# EAGLE design pico2_video (EAGLE 4.16)
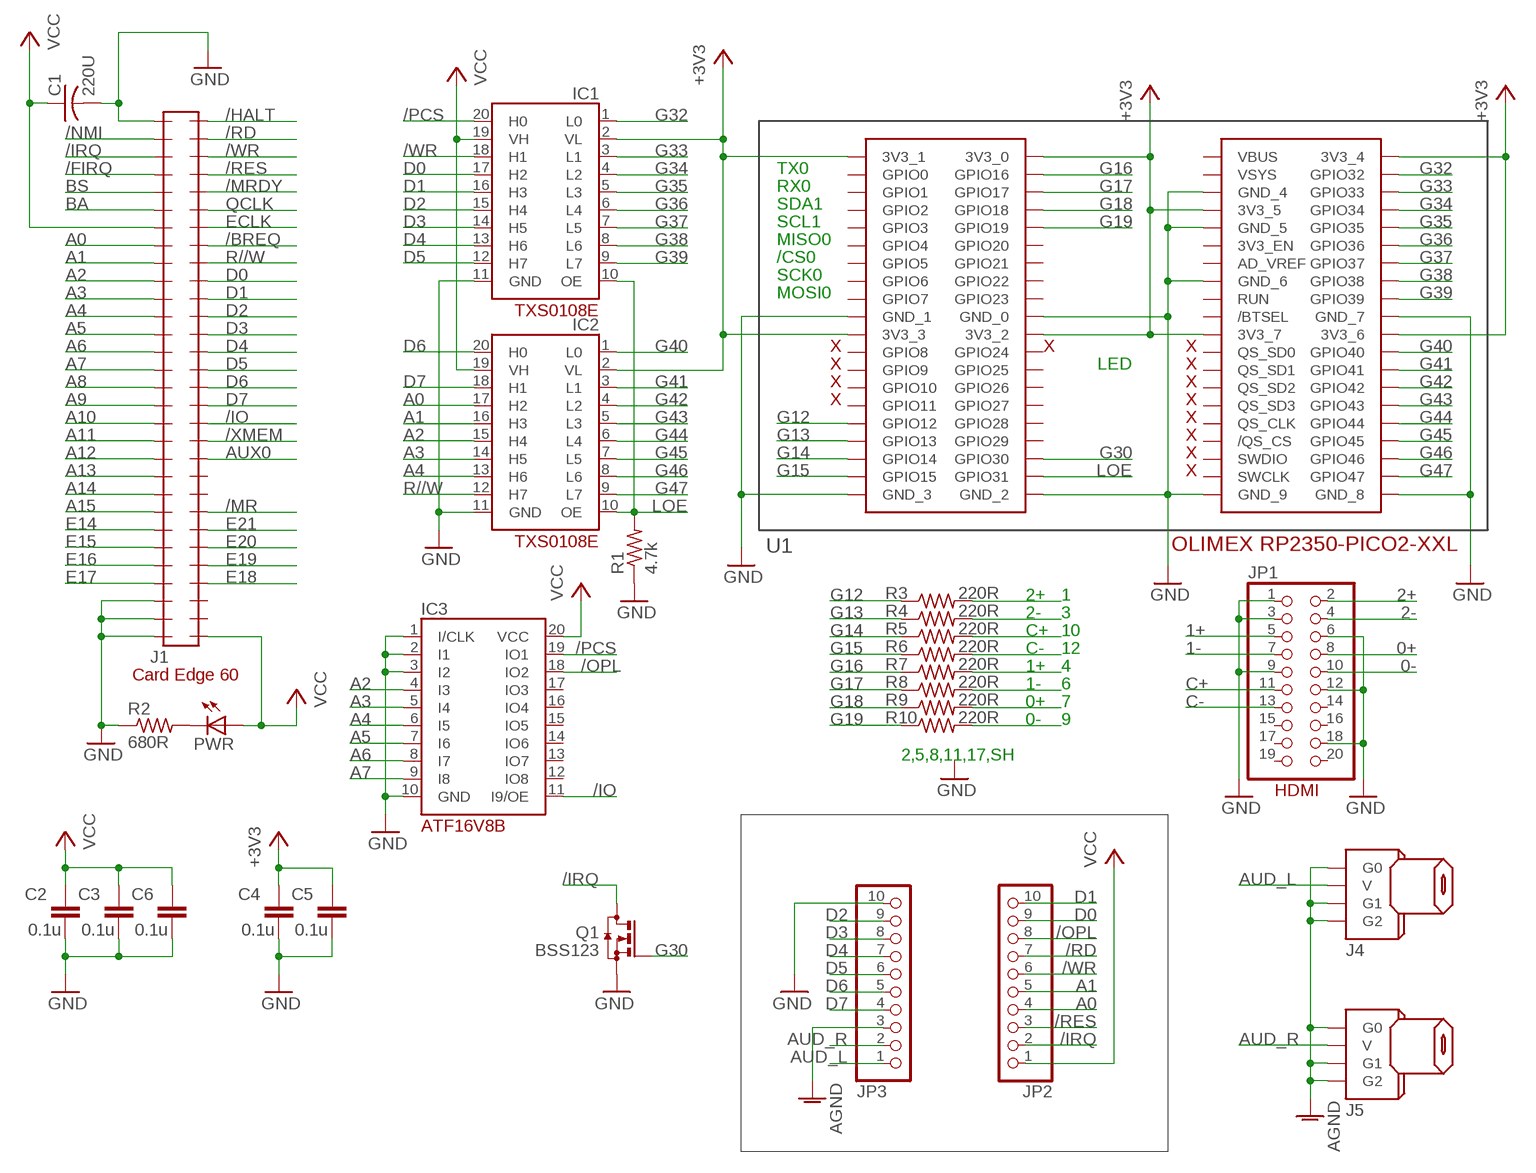
[diagram p0: schematic, sheet 1]

## Parts
C1  220U  C-US025-050X050  [C025-050X050]
C2  0.1u  C-EUC0603  [C0603]
C3  0.1u  C-EUC0603  [C0603]
C4  0.1u  C-EUC0603  [C0603]
C5  0.1u  C-EUC0603  [C0603]
C6  0.1u  C-EUC0603  [C0603]
IC1  TXS0108E  [TSSOP20]
IC2  TXS0108E  [TSSOP20]
IC3  PLD_ATF16V8B  [DIL20]
J1  CARDEDGE_2.54_60POS  CARDEDGE_2.54_60POSEDGE  [CARDEDGE_2.54_60POS]
J4  RCA_CONN_CUI_RCJ-014_CP-1403-ND  [RCA_JACK_CUI_RCJ-014_CP-1403-ND]
J5  RCA_CONN_CUI_RCJ-014_CP-1403-ND  [RCA_JACK_CUI_RCJ-014_CP-1403-ND]
JP1  PINHD-2X10  [2X10]
JP2  PINHD-1X10  [1X10]
JP3  PINHD-1X10  [1X10]
PWR  LED3MM  [LED3MM]
Q1  BSS123  [SOT23]
R1  4.7k  R-US_R0603  [R0603]
R2  680R  R-US_R0603  [R0603]
R3  220R  R-US_R0603  [R0603]
R4  220R  R-US_R0603  [R0603]
R5  220R  R-US_R0603  [R0603]
R6  220R  R-US_R0603  [R0603]
R7  220R  R-US_R0603  [R0603]
R8  220R  R-US_R0603  [R0603]
R9  220R  R-US_R0603  [R0603]
R10  220R  R-US_R0603  [R0603]
U1  OLIMEX_RP2350-PICO2-XXL  [OLIMEX_RP2350-PICO2-XXL]

## Nets
0+: JP1.8 R9.2
0-: JP1.10 R10.2
1+: JP1.5 R7.2
1-: JP1.7 R8.2
2+: JP1.2 R3.2
2-: JP1.4 R4.2
+3V3: C4.1 C5.1 IC1.2(VL) IC2.2(VL) U1.1.1(3V3_0) U1.1.2(3V3_1) U1.1.21(3V3_2) U1.1.22(3V3_3) U1.2.1(3V3_4) U1.2.8(3V3_5) U1.2.21(3V3_6) U1.2.22(3V3_7)
/BREQ: J1.53
/FIRQ: J1.4
/HALT: J1.60
/IO: IC3.11(I9/OE) J1.43
/IRQ: J1.3 JP2.2 Q1.3(D)
/MR: J1.38
/MRDY: J1.56
/NMI: J1.2
/OPL: IC3.18(IO2) JP2.8
/PCS: IC1.20(H0) IC3.19(IO1)
/RD: J1.59 JP2.7
/RES: J1.57 JP2.3
/WR: IC1.18(H1) J1.58 JP2.6
/XMEM: J1.42
A0: IC2.17(H2) J1.8 JP2.4
A1: IC2.16(H3) J1.9 JP2.5
A2: IC2.15(H4) IC3.4(I3) J1.10
A3: IC2.14(H5) IC3.5(I4) J1.11
A4: IC2.13(H6) IC3.6(I5) J1.12
A5: IC3.7(I6) J1.13
A6: IC3.8(I7) J1.14
A7: IC3.9(I8) J1.15
A8: J1.16
A9: J1.17
A10: J1.18
A11: J1.19
A12: J1.20
A13: J1.21
A14: J1.22
A15: J1.23
AGND [agnd]: J4.G0 J4.G1 J4.G2 J5.G0 J5.G1 J5.G2 JP3.3
AUD_L: J4.V JP3.1
AUD_R: J5.V JP3.2
AUX0: J1.41
BA: J1.6
BS: J1.5
C+: JP1.11 R5.2
C-: JP1.13 R6.2
D0: IC1.17(H2) J1.51 JP2.9
D1: IC1.16(H3) J1.50 JP2.10
D2: IC1.15(H4) J1.49 JP3.9
D3: IC1.14(H5) J1.48 JP3.8
D4: IC1.13(H6) J1.47 JP3.7
D5: IC1.12(H7) J1.46 JP3.6
D6: IC2.20(H0) J1.45 JP3.5
D7: IC2.18(H1) J1.44 JP3.4
E14: J1.24
E15: J1.25
E16: J1.26
E17: J1.27
E18: J1.34
E19: J1.35
E20: J1.36
E21: J1.37
ECLK: J1.54
G12: R3.1 U1.1.32(GPIO12)
G13: R4.1 U1.1.34(GPIO13)
G14: R5.1 U1.1.36(GPIO14)
G15: R6.1 U1.1.38(GPIO15)
G16: R7.1 U1.1.3(GPIO16)
G17: R8.1 U1.1.5(GPIO17)
G18: R9.1 U1.1.7(GPIO18)
G19: R10.1 U1.1.9(GPIO19)
G30: Q1.1(G) U1.1.35(GPIO30)
G32: IC1.1(L0) U1.2.3(GPIO32)
G33: IC1.3(L1) U1.2.5(GPIO33)
G34: IC1.4(L2) U1.2.7(GPIO34)
G35: IC1.5(L3) U1.2.9(GPIO35)
G36: IC1.6(L4) U1.2.11(GPIO36)
G37: IC1.7(L5) U1.2.13(GPIO37)
G38: IC1.8(L6) U1.2.15(GPIO38)
G39: IC1.9(L7) U1.2.17(GPIO39)
G40: IC2.1(L0) U1.2.23(GPIO40)
G41: IC2.3(L1) U1.2.25(GPIO41)
G42: IC2.4(L2) U1.2.27(GPIO42)
G43: IC2.5(L3) U1.2.29(GPIO43)
G44: IC2.6(L4) U1.2.31(GPIO44)
G45: IC2.7(L5) U1.2.33(GPIO45)
G46: IC2.8(L6) U1.2.35(GPIO46)
G47: IC2.9(L7) U1.2.37(GPIO47)
GND: C1.2 C2.2 C3.2 C4.2 C5.2 C6.2 IC1.11(GND) IC2.11(GND) IC3.1(I/CLK) IC3.2(I1) IC3.3(I2) IC3.10(GND) J1.1 J1.28 J1.29 J1.30 JP1.1 JP1.3 JP1.6 JP1.9 JP1.12 JP1.18 JP3.10 Q1.2(S) R1.1 R2.1 U1.1.19(GND_0) U1.1.20(GND_1) U1.1.39(GND_2) U1.1.40(GND_3) U1.2.6(GND_4) U1.2.10(GND_5) U1.2.16(GND_6) U1.2.19(GND_7) U1.2.39(GND_8) U1.2.40(GND_9)
LOE: IC1.10(OE) IC2.10(OE) R1.2 U1.1.37(GPIO31)
N$2: PWR.K(C) R2.2
QCLK: J1.55
R//W: IC2.12(H7) J1.52
VCC [supply]: C1.1 C2.1 C3.1 C6.1 IC1.19(VH) IC2.19(VH) IC3.20(VCC) J1.7 J1.31 JP2.1 PWR.A
Unconnected: IC3.12(IO8) IC3.13(IO7) IC3.14(IO6) IC3.15(IO5) IC3.16(IO4) IC3.17(IO3) J1.32 J1.33 J1.39 J1.40 JP1.14 JP1.15 JP1.16 JP1.17 JP1.19 JP1.20 U1.1.4(GPIO0) U1.1.6(GPIO1) U1.1.8(GPIO2) U1.1.10(GPIO3) U1.1.11(GPIO20) U1.1.12(GPIO4) U1.1.13(GPIO21) U1.1.14(GPIO5) U1.1.15(GPIO22) U1.1.16(GPIO6) U1.1.17(GPIO23) U1.1.18(GPIO7) U1.1.23(GPIO24) U1.1.24(GPIO8) U1.1.25(GPIO25) U1.1.26(GPIO9) U1.1.27(GPIO26) U1.1.28(GPIO10) U1.1.29(GPIO27) U1.1.30(GPIO11) U1.1.31(GPIO28) U1.1.33(GPIO29) U1.2.2(VBUS) U1.2.4(VSYS) U1.2.12(3V3_EN) U1.2.14(AD_VREF) U1.2.18(RUN) U1.2.20(/BTSEL) U1.2.24(QS_SD0) U1.2.26(QS_SD1) U1.2.28(QS_SD2) U1.2.30(QS_SD3) U1.2.32(QS_CLK) U1.2.34(/QS_CS) U1.2.36(SWDIO) U1.2.38(SWCLK)

## Notes on the sheet
- TX0
- RX0
- SDA1
- SCL1
- MISO0
- /CS0
- SCK0
- MOSI0
- X | X | X
- X | LED | X
- X | X
- X | X
- X
- X
- X
- X
- 2+ | 1
- 2- | 3
- C+ | 10
- C- | 12
- 1+ | 4
- 1- | 6
- 0+ | 7
- 0- | 9
- 2,5,8,11,17,SH
- HDMI

## Library data of the parts
C1 = rcl:C-US: CAPACITOR, American symbol
C2-C6 = rcl:C-EU: CAPACITOR, European symbol
IC1 IC2 = 07-Retrocomputing:TXS0108E
IC3 = 07-Retrocomputing:PLD_ATF16V8B
J1 = 07-Retrocomputing:CARDEDGE_2.54_60POS
J4 J5 = 07-Retrocomputing:RCA_CONN_CUI_RCJ-014_CP-1403-ND
JP1 = pinhead:PINHD-2X10: PIN HEADER
JP2 JP3 = pinhead:PINHD-1X10: PIN HEADER
PWR = led:LED: LED OSRAM: - CHIPLED LG R971, LG N971, LY N971, LG Q971, LY Q971, LO R971, LY R971 LH N974, LH R974 LS Q976, LO Q976, LY Q976 LO Q996 - Hyper CHIPLED LW Q18S LB Q993, LB Q99A, LB R99A - SideLED LS A670, LO A670, LY A670, LG A670, LP A670 LB A673, LV A673, LT A673, LW A673 LH A674 LY A675 LS A676, LA A676, LO A676, LY A676, LW A676 LS A679, LY A679, LG A679 - Hyper Micro SIDELED® LS Y876, LA Y876, LO Y876, LY Y876 LT Y87S - SmartLED LW L88C, LW L88S LB L89C, LB L89S, LG L890 LS L89K, LO L89K, LY L89K LS L896, LA L896, LO L896, LY L896 - TOPLED LS T670, LO T670, LY T670, LG T670, LP T670 LSG T670, LSP T670, LSY T670, LOP T670, LYG T670 LG T671, LOG T671, LSG T671 LB T673, LV T673, LT T673, LW T673 LH T674 LS T676, LA T676, LO T676, LY T676, LB T676, LH T676, LSB T676, LW T676 LB T67C, LV T67C, LT T67C, LS T67K, LO T67K, LY T67K, LW E67C LS E67B, LA E67B, LO E67B, LY E67B, LB E67C, LV E67C, LT E67C LW T67C LS T679, LY T679, LG T679 LS T770, LO T770, LY T770, LG T770, LP T770 LB T773, LV T773, LT T773, LW T773 LH T774 LS E675, LA E675, LY E675, LS T675 LS T776, LA T776, LO T776, LY T776, LB T776 LHGB T686 LT T68C, LB T68C - Hyper Mini TOPLED® LB M676 - Mini TOPLED Santana® LG M470 LS M47K, LO M47K, LY M47K Source: http://www.osram.convergy.de - LUMILED® LXK2-PW12-R00, LXK2-PW12-S00, LXK2-PW14-U00, LXK2-PW14-V00 LXK2-PM12-R00, LXK2-PM12-S00, LXK2-PM14-U00 LXK2-PE12-Q00, LXK2-PE12-R00, LXK2-PE12-S00, LXK2-PE14-T00, LXK2-PE14-U00 LXK2-PB12-K00, LXK2-PB12-L00, LXK2-PB12-M00, LXK2-PB14-N00, LXK2-PB14-P00, LXK2-PB14-Q00 LXK2-PR12-L00, LXK2-PR12-M00, LXK2-PR14-Q00, LXK2-PR14-R00 LXK2-PD12-Q00, LXK2-PD12-R00, LXK2-PD12-S00 LXK2-PH12-R00, LXK2-PH12-S00 LXK2-PL12-P00, LXK2-PL12-Q00, LXK2-PL12-R00 Source: www.luxeon.com
Q1 = transistor-small-signal:BSS123: N-CHANNEL MOS FET
R1-R10 = rcl:R-US_: RESISTOR, American symbol
U1 = 07-Retrocomputing:OLIMEX_RP2350-PICO2-XXL

## Net classes
0 default: width 0.203 mm, drill 0.203 mm, clearance 0.254 mm
1 supply: width 0.305 mm, drill 0.203 mm, clearance 0.254 mm
2 agnd: width 0.305 mm, drill 0.203 mm, clearance 0.254 mm

## Board
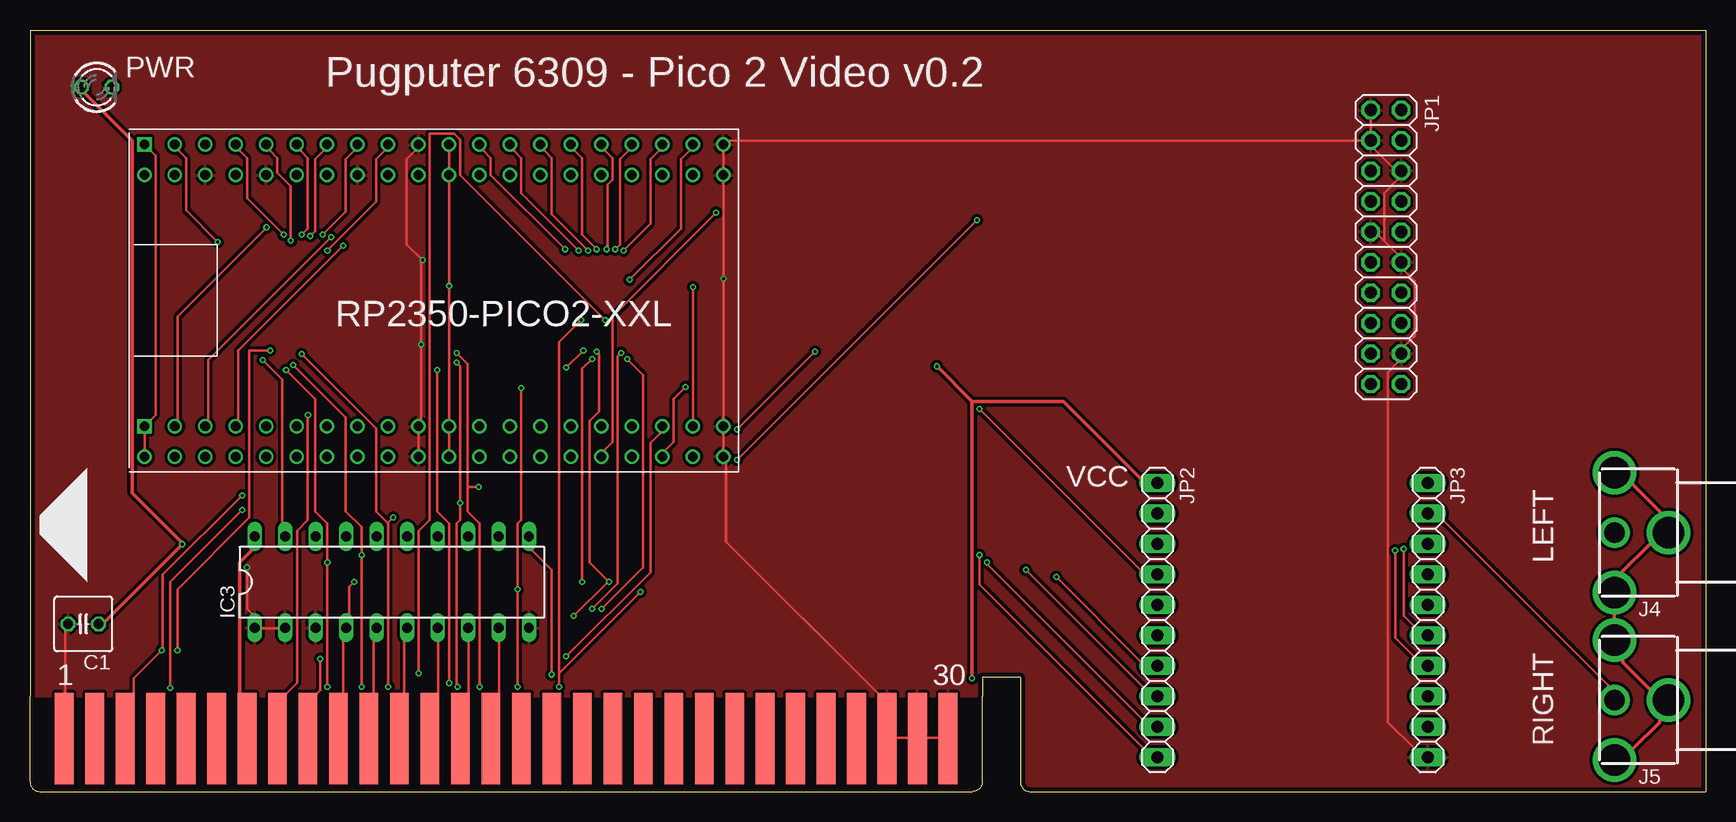
[diagram p1: board, top side]
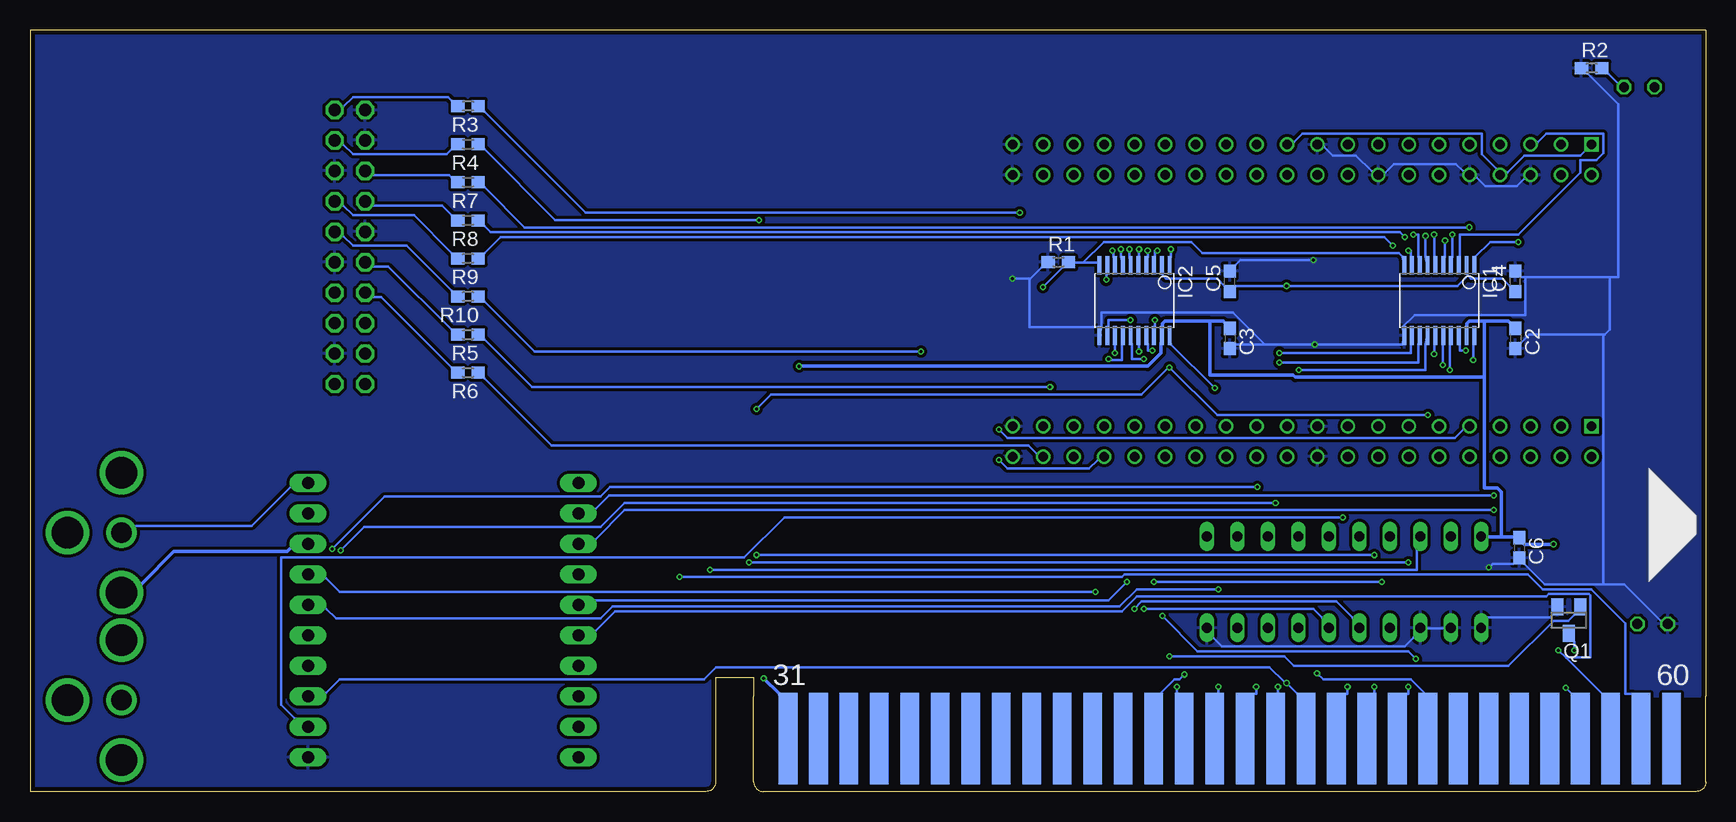
[diagram p2: board, bottom side, seen from below]

Size 139.7 x 63.5 mm. Coordinates in mm from the lower left corner, seen from the top.
Outline: 0,7.94 0,63.5 139.7,63.5 139.7,0 83.34,0 arc-90 82.55,0.79 82.55,9.53 79.38,9.53 79.38,7.94
Copper layers (1*16): Top 0.0356mm / dielectric 1.6mm / Bottom 0.0356mm
Design rules "oshpark-2layer": minimum track width 6mil, minimum drill 10mil, track to track 6mil, track to pad 6mil, pad to pad 6mil, via to via 6mil, smd to smd 6mil, copper to edge 15mil, drill to drill 6mil, minimum pad ring 5mil, minimum via ring 5mil, stop-mask expansion 2.5mil, vias tented up to drill 0mil, thermal gap 10mil

### Footprints (pad centres in the part's own frame; a part is rotated, then mirrored left to right if it is on the bottom)
C025-050X050 = drill 0.813 octagon: 1 -1.27,0; 2 1.27,0
C0603 = smd 1.1 x 1: 1 -0.85,0; 2 0.85,0
TSSOP20 = smd 1.5 x 0.35: 1 -2.925,2.925; 2 -2.925,2.275; 3 -2.925,1.625; 4 -2.925,0.975; 5 -2.925,0.325; 6 -2.925,-0.325; 7 -2.925,-0.975; 8 -2.925,-1.625; 9 -2.925,-2.275; 10 -2.925,-2.925; 11 2.925,-2.925; 12 2.925,-2.275; 13 2.925,-1.625; 14 2.925,-0.975; 15 2.925,-0.325; 16 2.925,0.325; 17 2.925,0.975; 18 2.925,1.625; 19 2.925,2.275; 20 2.925,2.925
DIL20 = drill 0.813 long: 1 -11.43,-3.81; 2 -8.89,-3.81; 3 -6.35,-3.81; 4 -3.81,-3.81; 5 -1.27,-3.81; 6 1.27,-3.81; 7 3.81,-3.81; 8 6.35,-3.81; 9 8.89,-3.81; 10 11.43,-3.81; 11 11.43,3.81; 12 8.89,3.81; 13 6.35,3.81; 14 3.81,3.81; 15 1.27,3.81; 16 -1.27,3.81; 17 -3.81,3.81; 18 -6.35,3.81; 19 -8.89,3.81; 20 -11.43,3.81
CARDEDGE_2.54_60POS = smd 1.556 x 7.62: 1 -36.83,4.41; 2 -34.29,4.41; 3 -31.75,4.41; 4 -29.21,4.41; 5 -26.67,4.41; 6 -24.13,4.41; 7 -21.59,4.41; 8 -19.05,4.41; 9 -16.51,4.41; 10 -13.97,4.41; 11 -11.43,4.41; 12 -8.89,4.41; 13 -6.35,4.41; 14 -3.81,4.41; 15 -1.27,4.41; 16 1.27,4.41; 17 3.81,4.41; 18 6.35,4.41; 19 8.89,4.41; 20 11.43,4.41; 21 13.97,4.41; 22 16.51,4.41; 23 19.05,4.41; 24 21.59,4.41; 25 24.13,4.41; 26 26.67,4.41; 27 29.21,4.41; 28 31.75,4.41; 29 34.29,4.41; 30 36.83,4.41 | smd 1.556 x 7.62 bottom: 31 36.83,4.41; 32 34.29,4.41; 33 31.75,4.41; 34 29.21,4.41; 35 26.67,4.41; 36 24.13,4.41; 37 21.59,4.41; 38 19.05,4.41; 39 16.51,4.41; 40 13.97,4.41; 41 11.43,4.41; 42 8.89,4.41; 43 6.35,4.41; 44 3.81,4.41; 45 1.27,4.41; 46 -1.27,4.41; 47 -3.81,4.41; 48 -6.35,4.41; 49 -8.89,4.41; 50 -11.43,4.41; 51 -13.97,4.41; 52 -16.51,4.41; 53 -19.05,4.41; 54 -21.59,4.41; 55 -24.13,4.41; 56 -26.67,4.41; 57 -29.21,4.41; 58 -31.75,4.41; 59 -34.29,4.41; 60 -36.83,4.41
RCA_JACK_CUI_RCJ-014_CP-1403-ND = drill 2.6 round: G0 -5,0; G1 0,4.5; G2 5,0 | drill 1.7 round: V 0,0
2X10 = drill 1.016 octagon: 1 -11.43,-1.27; 2 -11.43,1.27; 3 -8.89,-1.27; 4 -8.89,1.27; 5 -6.35,-1.27; 6 -6.35,1.27; 7 -3.81,-1.27; 8 -3.81,1.27; 9 -1.27,-1.27; 10 -1.27,1.27; 11 1.27,-1.27; 12 1.27,1.27; 13 3.81,-1.27; 14 3.81,1.27; 15 6.35,-1.27; 16 6.35,1.27; 17 8.89,-1.27; 18 8.89,1.27; 19 11.43,-1.27; 20 11.43,1.27
1X10 = drill 1.016 long: 1 -11.43,0; 2 -8.89,0; 3 -6.35,0; 4 -3.81,0; 5 -1.27,0; 6 1.27,0; 7 3.81,0; 8 6.35,0; 9 8.89,0; 10 11.43,0
LED3MM = drill 0.813 octagon: A -1.27,0; K 1.27,0
SOT23 = smd 1 x 1.4: 1 -0.95,-1.1; 2 0.95,-1.1; 3 0,1.1
R0603 = smd 1.1 x 1: 1 -0.85,0; 2 0.85,0
OLIMEX_RP2350-PICO2-XXL = drill 0.8 square: 1.1 -10.5,0; 2.1 12.995,0 | drill 0.8 round: 1.2 -13.04,0; 1.3 -10.5,-2.54; 1.4 -13.04,-2.54; 1.5 -10.5,-5.08; 1.6 -13.04,-5.08; 1.7 -10.5,-7.62; 1.8 -13.04,-7.62; 1.9 -10.5,-10.16; 1.10 -13.04,-10.16; 1.11 -10.5,-12.7; 1.12 -13.04,-12.7; 1.13 -10.5,-15.24; 1.14 -13.04,-15.24; 1.15 -10.5,-17.78; 1.16 -13.04,-17.78; 1.17 -10.5,-20.32; 1.18 -13.04,-20.32; 1.19 -10.5,-22.86; 1.20 -13.04,-22.86; 1.21 -10.5,-25.4; 1.22 -13.04,-25.4; 1.23 -10.5,-27.94; 1.24 -13.04,-27.94; 1.25 -10.5,-30.48; 1.26 -13.04,-30.48; 1.27 -10.5,-33.02; 1.28 -13.04,-33.02; 1.29 -10.5,-35.56; 1.30 -13.04,-35.56; 1.31 -10.5,-38.1; 1.32 -13.04,-38.1; 1.33 -10.5,-40.64; 1.34 -13.04,-40.64; 1.35 -10.5,-43.18; 1.36 -13.04,-43.18; 1.37 -10.5,-45.72; 1.38 -13.04,-45.72; 1.39 -10.5,-48.26; 1.40 -13.04,-48.26; 2.2 10.455,0; 2.3 12.995,-2.54; 2.4 10.455,-2.54; 2.5 12.995,-5.08; 2.6 10.455,-5.08; 2.7 12.995,-7.62; 2.8 10.455,-7.62; 2.9 12.995,-10.16; 2.10 10.455,-10.16; 2.11 12.995,-12.7; 2.12 10.455,-12.7; 2.13 12.995,-15.24; 2.14 10.455,-15.24; 2.15 12.995,-17.78; 2.16 10.455,-17.78; 2.17 12.995,-20.32; 2.18 10.455,-20.32; 2.19 12.995,-22.86; 2.20 10.455,-22.86; 2.21 12.995,-25.4; 2.22 10.455,-25.4; 2.23 12.995,-27.94; 2.24 10.455,-27.94; 2.25 12.995,-30.48; 2.26 10.455,-30.48; 2.27 12.995,-33.02; 2.28 10.455,-33.02; 2.29 12.995,-35.56; 2.30 10.455,-35.56; 2.31 12.995,-38.1; 2.32 10.455,-38.1; 2.33 12.995,-40.64; 2.34 10.455,-40.64; 2.35 12.995,-43.18; 2.36 10.455,-43.18; 2.37 12.995,-45.72; 2.38 10.455,-45.72; 2.39 12.995,-48.26; 2.40 10.455,-48.26

### Placement (x,y rotation side)
C1  4.45,13.97 180 top
C2  15.88,37.78 270 bottom
C3  39.69,37.78 270 bottom
C4  15.88,42.55 90 bottom
C5  39.69,42.55 90 bottom
C6  15.56,20.32 270 bottom
IC1  22.23,40.96 270 bottom
IC2  47.62,40.96 270 bottom
IC3  30.16,17.46 0 top
J1  39.69,0 0 top
J4  132.08,21.59 270 top
J5  132.08,7.62 270 top
JP1  113.03,45.4 270 top
JP2  93.98,14.29 270 top
JP3  116.52,14.29 270 top
PWR  5.56,58.74 0 top
Q1  11.43,14.29 180 bottom
R1  53.98,44.13 0 bottom
R2  9.53,60.33 0 bottom
R3  103.19,57.15 180 bottom
R4  103.19,53.98 180 bottom
R5  103.19,38.1 180 bottom
R6  103.19,34.92 180 bottom
R7  103.19,50.8 180 bottom
R8  103.19,47.62 180 bottom
R9  103.19,44.45 180 bottom
R10  103.19,41.27 180 bottom
U1  9.53,40.96 90 top

### Tracks (layer width: path | path; a pad name or v marks a point on that pad's centre or on a via)
0+
  Bottom 0.203: R9.2 104.55,44.91 107.7,48.06 112.78,48.06 113.59,48.87 JP1.8
0-
  Bottom 0.203: R10.2 104.55,41.76 108.31,45.52 112.78,45.52 113.59,46.33 JP1.10
1+
  Bottom 0.203: R7.2 104.55,51.21 104.75,51.41 111.05,51.41 JP1.5
1-
  Bottom 0.203: R8.2 104.55,48.06 105.36,48.87 111.05,48.87 JP1.7
2+
  Bottom 0.203: R3.2 104.55,57.61 104.85,57.91 112.78,57.91 113.59,57.1 JP1.2
2-
  Bottom 0.203: R4.2 104.55,53.54 104.95,53.14 112.78,53.14 113.59,53.95 JP1.4
+3V3  (via drill 0.25)
  Top 0.203: U1.1.2 9.55,28.45 9.55,29.87 U1.1.1 10.06,30.99 10.46,31.39 10.46,53.03 10.06,53.44 U1.2.1 | U1.1.22 34.95,28.45 34.95,29.87 U1.1.21 34.95,30.99 v34.95,42.16 34.95,50.9 U1.2.22 34.95,51.92 34.95,53.44 U1.2.21
  Bottom 0.203: U1.2.1 10.06,53.44 10.46,53.03 15.14,53.03 16.56,51.61 U1.2.8 17.48,51.92 18.69,53.14 18.69,54.86 33.63,54.86 34.34,54.15 U1.2.21 | 19.86,43.03 20.02,43.18 IC1.2 | 19.86,43.03 19.61,42.77 16.97,42.77 16.36,42.16 C4.1 | IC2.2 45.41,43.18 45.01,42.77 40.74,42.77 40.13,42.16 C5.1 39.22,42.16 v34.95,42.16 20.73,42.16 19.86,43.03
/IO  (via drill 0.25)
  Top 0.203: v43.48,9.75 43.48,18.49 41.86,20.12 IC3.11
  Bottom 0.203: v43.48,9.75 43.89,9.35 44.3,9.35 45.52,8.13 J1.43
/IRQ  (via drill 0.25)
  Top 0.203: J1.3 8.64,8.13 8.64,9.45 v10.97,11.79 11.07,11.99 11.07,18.09 v17.68,24.69
  Bottom 0.203: v10.97,11.79 10.97,12.5 Q1.3 | v17.68,24.69 91.44,24.69 92.56,23.57 JP2.2
/OPL  (via drill 0.25)
  Top 0.203: v83.01,18.49 92.86,8.64 JP2.8
  Bottom 0.203: v83.01,18.49 24.08,18.49 24.08,20.12 IC3.18
/PCS  (via drill 0.25)
  Top 0.203: v19.41,35.97 21.03,34.34 21.03,22.45 IC3.19
  Bottom 0.203: v19.41,35.97 19.41,37.29 IC1.20
/RD  (via drill 0.25)
  Top 0.203: v85.55,17.88 92.56,10.87 JP2.7
  Bottom 0.203: v85.55,17.88 48.67,17.88 48.46,18.09 14.83,18.09 13.61,16.87 9.55,16.87 6.71,14.02 6.71,8.13 6.1,8.13 J1.59
/RES  (via drill 0.25)
  Top 0.203: v17.68,23.47 11.68,17.48 v11.68,8.64
  Bottom 0.203: v17.68,23.47 90.12,23.47 92.56,21.03 JP2.3 | v11.68,8.64 11.18,8.13 J1.57
/WR  (via drill 0.25)
  Top 0.203: v20.02,36.78 18.29,36.78 18.29,22.86 12.29,16.87 v12.29,11.79
  Bottom 0.203: v20.02,36.78 20.52,36.78 20.52,37.29 IC1.18 | 11.63,11.12 8.64,8.13 J1.58 | 11.63,11.12 v12.29,11.79 | JP2.6 92.56,13.41 90.93,15.04 48.67,15.04 47.45,16.26 13.31,16.26 13.11,16.46 9.75,16.46 9.65,16.36 9.65,11.18 11.58,11.18 11.63,11.12
A0  (via drill 0.25)
  Top 0.203: v44.7,35.36 v46.13,36.78 | v23.16,31.39 23.16,22.66 22.25,21.74 22.25,9.04 21.34,8.13 J1.8 | v79.15,31.9 92.56,18.49 JP2.4
  Bottom 0.203: v46.13,36.78 46.53,36.78 46.53,37.29 IC2.17 | v23.16,31.39 40.74,31.39 v44.7,35.36 44.91,35.26 47.04,33.12 77.93,33.12 v79.15,31.9
A1  (via drill 0.25)
  Top 0.203: v47.24,36.68 47.45,36.47 47.45,31.7 46.63,30.89 46.63,19.1 v48.26,17.48 48.06,17.37 v45.31,14.63 | v24.18,11.07 24.18,8.43 23.88,8.13 J1.9
  Bottom 0.203: v47.24,36.68 47.24,37.29 IC2.16 | v48.26,17.48 49.78,15.95 92.56,15.95 JP2.5 | v24.18,11.07 24.79,11.68 42.37,11.68 v45.31,14.63
A2  (via drill 0.25)
  Top 0.203: v46.84,36.07 46.02,35.26 v46.02,17.48 | v27.03,17.48 26.62,17.07 26.62,14.83 IC3.4 26.11,12.5 26.11,8.13 J1.10
  Bottom 0.203: v46.84,36.07 47.85,36.07 47.85,37.29 IC2.15 | v27.03,17.48 v46.02,17.48
A3  (via drill 0.25)
  Top 0.203: v49.78,36.07 51.1,34.75 51.1,18.69 v47.65,15.24 | J1.11 28.65,8.13 28.65,12.5 IC3.5
  Bottom 0.203: v49.78,36.07 49.68,35.97 48.67,35.97 48.67,37.29 IC2.14 | v47.65,15.24 47.04,15.85 30.79,15.85 29.46,14.53 IC3.5
A4  (via drill 0.25)
  Top 0.203: v49.28,36.58 48.97,36.27 48.97,17.37 v46.84,15.24 | J1.12 31.19,8.13 31.19,12.5 IC3.6
  Bottom 0.203: v49.28,36.58 49.28,37.29 IC2.13 | v46.84,15.24 32.72,15.24 32,14.53 IC3.6
A5
  Top 0.203: IC3.7 34.04,12.5 34.04,8.13 J1.13
A6
  Top 0.203: IC3.8 36.58,12.5 36.58,8.13 J1.14
A7
  Top 0.203: IC3.9 39.12,12.5 39.12,8.13 J1.15
AGND
  Top 0.305: J4.G0 133.6,25.6 135.84,23.37 J4.G1 135.03,20.62 132.79,18.39 J4.G2 J5.G0 132.79,10.87 132.79,10.77 135.03,8.53 J5.G1 135.84,5.89 135.84,5.79 133.6,3.56 J5.G2
  Bottom 0.305: JP3.3 117.96,20.32 118.26,20.02 127.71,20.02 130.35,17.37 J4.G2
AUD_L
  Bottom 0.203: JP3.1 117.96,25.4 121.21,22.15 130.86,22.15 J4.V
AUD_R
  Top 0.203: JP3.2 117.75,22.66 131.57,8.84 J5.V
C+
  Bottom 0.203: R5.2 104.55,38.51 109.83,43.79 111.05,43.79 JP1.11
C-
  Bottom 0.203: R6.2 104.55,35.36 110.44,41.25 111.05,41.25 JP1.13
D0  (via drill 0.25)
  Top 0.203: v21.34,35.15 23.77,32.72 23.77,23.37 24.79,22.35 v24.79,19.1 v24.79,8.74 | v79.76,19.1 79.76,19 92.76,5.99 JP2.9
  Bottom 0.203: v21.34,35.15 21.34,37.29 IC1.17 | v24.79,8.74 24.79,8.13 24.99,8.13 J1.51 | v24.79,19.1 v79.76,19.1
D1  (via drill 0.25)
  Top 0.203: v21.95,35.56 26.31,31.19 26.31,23.37 27.64,22.05 v27.64,19.71 v27.64,8.74 | v79.15,19.71 79.15,17.27 92.86,3.56 JP2.10
  Bottom 0.203: v21.95,35.56 21.95,37.29 IC1.16 | v27.64,8.74 27.64,8.13 J1.50 | v27.64,19.71 v79.15,19.71
D2  (via drill 0.25)
  Top 0.203: v22.66,36.47 28.85,30.28 28.85,23.37 29.82,22.4 | 29.82,22.4 29.87,22.35 v29.87,8.74 | 29.82,22.4 v30.28,22.86
  Bottom 0.203: v22.66,36.47 22.66,37.29 IC1.15 | v29.87,8.74 29.87,8.13 30.07,8.13 J1.49 | v30.28,22.86 76.81,22.86 80.16,19.51 118.77,19.51 118.77,7.21 117.65,6.1 JP3.9
D3  (via drill 0.25)
  Top 0.203: v33.93,35.15 33.93,23.37 34.95,22.35 v34.95,9.04
  Bottom 0.203: v33.93,35.15 23.37,35.15 23.37,37.29 IC1.14 | J1.48 34.04,8.13 v34.95,9.04 35.15,9.14 36.37,10.36 82.5,10.36 83.52,9.35 113.89,9.35 115.01,8.23 JP3.8
D4  (via drill 0.25)
  Top 0.203: v35.56,35.76 35.87,35.46 v35.87,24.08 35.87,22.66 35.56,22.35 35.56,8.84 v35.66,8.74 | v113.79,20.12 113.79,12.8 115.42,11.18 JP3.7
  Bottom 0.203: v35.56,35.76 23.98,35.76 23.98,37.29 IC1.13 | v35.66,8.74 35.66,8.13 J1.47 | v113.79,20.12 111.86,22.05 92.15,22.05 90.12,24.08 v35.87,24.08
D5  (via drill 0.25)
  Top 0.203: v35.56,36.58 36.47,35.66 36.47,25.4 | 36.47,25.4 36.47,23.37 37.49,22.35 v37.49,8.74 | v114.5,20.22 114.5,14.63 115.42,13.72 JP3.6 | 36.47,25.4 v37.39,25.4
  Bottom 0.203: v35.56,36.58 24.59,36.58 24.59,37.29 IC1.12 | v37.49,8.74 37.49,8.13 37.69,8.13 J1.46 | v114.5,20.22 110.13,24.59 92.15,24.59 91.34,25.4 v37.39,25.4
D6  (via drill 0.25)
  Top 0.203: v40.95,33.63 40.95,22.66 40.64,22.35 v40.64,16.87 v40.64,8.74
  Bottom 0.203: v40.95,33.63 44.6,37.29 IC2.20 | v40.64,8.74 40.64,8.13 J1.45 | v40.64,16.87 47.45,16.87 48.87,15.44 91.14,15.44 92.15,14.43 114.2,14.43 115.01,15.24 JP3.5
D7  (via drill 0.25)
  Top 0.203: v45.92,39.32 44.09,37.49 44.09,9.86 | v44.09,8.74 44.09,9.86 | 44.09,9.86 v50.9,16.66
  Bottom 0.203: v45.92,39.32 45.92,38.71 IC2.18 | v44.09,8.74 44.09,8.13 J1.44 | v50.9,16.66 113.89,16.66 115.01,17.78 JP3.4
G12  (via drill 0.25)
  Top 0.203: v57.2,48.26 48.56,39.62 48.56,29.16 47.85,28.45 U1.1.32
  Bottom 0.203: v57.2,48.26 93.37,48.26 101.8,56.69 R3.1
G13  (via drill 0.25)
  Top 0.203: v58.93,27.64 v78.94,47.65
  Bottom 0.203: v78.94,47.65 95.91,47.65 101.8,53.54 R4.1 | v58.93,27.64 58.22,26.92 51.41,26.92 50.7,27.64 U1.1.34
G14  (via drill 0.25)
  Top 0.203: v54.66,33.73 53.65,32.72 53.65,29.16 52.93,28.45 U1.1.36
  Bottom 0.203: v54.66,33.73 97.84,33.73 101.8,37.69 R5.1
G15
  Bottom 0.203: R6.1 101.8,34.44 96.22,28.85 56.49,28.85 55.78,28.14 U1.1.38
G16  (via drill 0.25)
  Top 0.203: v19.71,47.04 12.29,39.62 12.29,30.99 U1.1.3
  Bottom 0.203: v19.71,47.04 98.45,47.04 101.8,50.39 R7.1
G17  (via drill 0.25)
  Top 0.203: v25.09,46.23 14.83,35.97 14.83,30.99 U1.1.5
  Bottom 0.203: v25.09,46.23 25.5,46.63 101.3,46.63 101.8,47.14 R8.1
G18  (via drill 0.25)
  Top 0.203: v26.11,45.52 17.37,36.78 17.37,30.99 U1.1.7
  Bottom 0.203: v26.11,45.52 26.82,46.23 100.48,46.23 101.8,44.91 R9.1
G19  (via drill 0.25)
  Top 0.203: v58.93,30.18 v65.43,36.68
  Bottom 0.203: v65.43,36.68 97.64,36.68 101.8,40.84 R10.1 | v58.93,30.18 58.22,29.46 20.93,29.46 20.22,30.18 U1.1.9
G30  (via drill 0.25)
  Top 0.203: v44.7,11.28 51.71,18.29 51.71,29.06 52.53,29.87 U1.1.35
  Bottom 0.203: v44.7,11.28 35.15,11.28 34.34,10.46 16.46,10.46 12.7,14.22 11.48,14.22 10.97,14.73 Q1.1
G32  (via drill 0.25)
  Top 0.203: v15.65,45.82 13.01,48.46 13.01,52.83 12.39,53.44 U1.2.3
  Bottom 0.203: v15.65,45.82 17.98,45.82 19.2,44.6 IC1.1
G33
  Bottom 0.203: IC1.3 20.52,44.6 20.52,46.43 15.65,46.43 10.46,51.61 10.46,52.63 9.14,52.63 8.53,53.24 8.53,54.86 13.31,54.86 14.02,54.15 U1.2.5
G34  (via drill 0.25)
  Top 0.203: v21.13,46.43 18.09,49.48 18.09,52.83 17.48,53.44 U1.2.7
  Bottom 0.203: v21.13,46.43 21.13,44.6 IC1.4
G35  (via drill 0.25)
  Top 0.203: v21.74,45.92 21.74,50.49 20.62,51.61 20.62,52.83 20.02,53.44 U1.2.9
  Bottom 0.203: v21.74,45.92 21.74,44.6 IC1.5
G36  (via drill 0.25)
  Top 0.203: v22.66,46.43 23.16,46.94 23.16,52.83 22.55,53.44 U1.2.11
  Bottom 0.203: v22.66,46.43 22.66,44.6 IC1.6
G37  (via drill 0.25)
  Top 0.203: v23.37,46.33 23.77,46.74 23.77,52.73 24.49,53.44 U1.2.13
  Bottom 0.203: v23.37,46.33 23.37,44.6 IC1.7
G38  (via drill 0.25)
  Top 0.203: v24.38,46.43 26.31,48.36 26.31,52.73 27.03,53.44 U1.2.15
  Bottom 0.203: v24.38,46.43 23.98,46.43 23.98,44.6 IC1.8
G39  (via drill 0.25)
  Top 0.203: v24.79,45.11 28.85,49.17 28.85,52.73 29.57,53.44 U1.2.17
  Bottom 0.203: v24.79,45.11 24.59,45.11 24.59,44.6 IC1.9
G40  (via drill 0.25)
  Top 0.203: v44.6,45.21 38.41,51.41 38.41,52.83 37.8,53.44 U1.2.23
  Bottom 0.203: v44.6,45.21 44.6,44.6 IC2.1
G41  (via drill 0.25)
  Top 0.203: v45.72,45.11 40.95,49.89 40.95,52.83 40.34,53.44 U1.2.25
  Bottom 0.203: v45.72,45.11 45.92,45.11 45.92,44.6 IC2.3
G42  (via drill 0.25)
  Top 0.203: v46.53,45.11 43.48,48.16 43.48,52.83 42.88,53.44 U1.2.27
  Bottom 0.203: v46.53,45.11 46.53,44.6 IC2.4
G43  (via drill 0.25)
  Top 0.203: v47.24,45.21 46.02,46.43 46.02,52.83 45.41,53.44 U1.2.29
  Bottom 0.203: v47.24,45.21 47.24,44.6 IC2.5
G44  (via drill 0.25)
  Top 0.203: v48.06,45.21 48.16,45.31 48.16,50.6 48.56,51 48.56,52.83 47.95,53.44 U1.2.31
  Bottom 0.203: v48.06,45.21 48.06,44.6 IC2.6
G45  (via drill 0.25)
  Top 0.203: v48.77,45.21 49.17,45.62 49.17,52.73 49.89,53.44 U1.2.33
  Bottom 0.203: v48.77,45.21 48.77,44.6 IC2.7
G46  (via drill 0.25)
  Top 0.203: v49.48,45.11 51.71,47.35 51.71,52.73 52.43,53.44 U1.2.35
  Bottom 0.203: v49.48,45.11 49.38,45.11 49.38,44.6 IC2.8
G47  (via drill 0.25)
  Top 0.203: v49.99,42.67 54.25,46.94 54.25,52.73 54.97,53.44 U1.2.37
  Bottom 0.203: v49.99,42.67 49.99,43.18 IC2.9
GND  (via drill 0.25)
  Top 0.203: IC3.2 20.73,13.61 19.3,13.61 IC3.1 18.49,14.83 18.09,15.24 v18.09,18.69 | J1.1 2.95,8.13 2.95,13.41 C1.2 | U1.1.20 32.41,28.45 32.41,29.87 U1.1.19 32.61,30.99 v32.61,37.29 32.61,44.09 v32.72,44.3 31.39,45.62 31.39,52.73 32.11,53.44 U1.2.19 | JP1.3 JP1.1 | JP1.3 112.06,53.54 113.59,52.02 JP1.6 114,51 112.88,49.89 112.88,46.02 112.83,45.97 | JP3.10 115.42,3.56 113.18,5.79 113.18,34.95 114,35.76 JP1.18 114.61,37.19 115.42,38 115.42,42.57 114.61,43.38 JP1.12 114,44.81 112.83,45.97 | 112.83,45.97 112.47,46.33 JP1.9 | J1.30 75.79,4.47 74.68,4.47 J1.29 73.25,4.47 72.14,4.47 J1.28 70.71,8.13 58.01,20.83 58.01,27.33 U1.1.40 57.81,28.45 57.81,29.87 U1.1.39 57.81,30.99 v57.81,42.77 57.81,50.9 U1.2.40 57.81,51.92 57.81,53.44 U1.2.39 58.32,54.25 111.05,54.25 JP1.3
  Bottom 0.203: Q1.2 12.8,14.73 13.01,14.53 18.19,14.53 IC3.1 | IC3.2 21.84,13.61 23.27,13.61 IC3.3 24.38,12.8 25.09,12.09 40.34,12.09 41.05,12.8 IC3.10 | 8.53,17.27 6.81,17.27 3.76,14.22 C1.2 | 8.53,17.27 13.41,17.27 15.14,19 C6.2 16.05,19 17.78,19 v18.09,18.69 | U1.2.6 15.14,51.1 15.75,50.49 18.39,50.49 19.1,51.21 U1.2.10 20.22,51.71 20.83,52.32 26.01,52.32 26.72,51.61 U1.2.16 27.84,51.71 29.16,53.03 31.09,53.03 31.8,53.75 U1.2.19 | v32.72,44.3 38.81,44.3 39.22,43.89 C5.2 | 8.53,38.1 8.43,38.1 8.03,38.51 8.03,42.88 | 8.53,38.1 14.73,38.1 15.44,37.39 C2.2 | 15.04,42.88 15.44,42.88 C4.2 | 8.03,42.88 15.04,42.88 | 8.03,42.88 7.32,42.88 7.32,57.3 9.86,59.84 R2.1 | 56.34,42.72 56.39,42.67 56.39,38.71 50.7,38.71 IC2.11 50.39,38.71 50.39,39.93 39.42,39.93 36.78,37.29 | 56.34,42.72 55.37,43.69 R1.1 | 36.78,37.29 v32.61,37.29 25.3,37.29 IC1.11 25.3,38.71 24.28,39.73 15.04,39.73 15.04,42.88 | 36.78,37.29 39.22,37.29 C3.2 | 8.53,17.27 8.53,38.1 | v57.81,42.77 56.39,42.77 56.34,42.72
  pour Top: 0,63.5 139.7,63.5 139.7,0 82.55,0 82.55,7.94 0,7.94
  pour Bottom: 0,7.94 82.55,7.94 82.55,0 139.7,0 139.7,63.5 0,63.5
LOE  (via drill 0.25)
  Top 0.203: v55.27,42.06 55.27,30.99 U1.1.37
  Bottom 0.203: 51.92,44.09 50.7,44.09 IC2.10 | 51.92,44.09 52.63,44.09 R1.2 53.65,43.69 v55.27,42.06 | 51.92,44.09 50.19,45.82 42.88,45.82 41.96,44.91 25.6,44.91 25.3,44.6 IC1.10
N$2
  Bottom 0.203: R2.2 8.13,59.84 7.32,59.03 PWR.K
R//W  (via drill 0.25)
  Top 0.203: v47.95,39.32 35.87,51.41 35.87,54.36 35.36,54.86 33.33,54.86 33.33,22.66 32.41,21.74 v32.41,9.86
  Bottom 0.203: v47.95,39.32 49.78,39.32 49.78,38.71 IC2.12 | v32.41,9.86 31.9,9.35 24.59,9.35 23.37,8.13 J1.52
VCC  (via drill 0.25)
  Top 0.305: 78.54,32.51 86.16,32.51 92.56,26.11 JP2.1 | 78.54,32.51 v78.54,9.45 | C1.1 6.3,14.22 v12.7,20.62 12.6,20.83 8.53,24.89 8.53,54.25 4.57,58.22 PWR.A | J1.7 17.48,8.13 17.48,19.1 18.49,20.12 IC3.20 | v75.59,35.46 78.54,32.51
  Bottom 0.305: v78.54,9.45 77.22,8.13 J1.31 | 41.35,39.22 45.11,39.22 45.31,39.01 45.31,38.71 IC2.19 45.41,37.29 45.41,36.58 46.53,35.46 v75.59,35.46 | 41.35,39.22 40.23,39.22 40.13,39.12 C3.1 | 18.49,39.22 19.71,39.22 19.91,39.01 19.91,38.71 IC1.19 | 18.49,39.22 16.46,39.22 16.36,39.12 C2.1 | 17.07,21.23 18.19,21.23 IC3.20 | 17.07,21.23 16.05,21.23 C6.1 15.14,20.62 v12.7,20.62 | 18.49,34.54 18.49,25.3 17.37,25.3 17.07,24.99 17.07,21.23 | 18.49,34.54 18.49,39.22 | 41.35,39.22 41.35,34.75 34.44,34.75 34.24,34.54 18.49,34.54

### Text on the board
tPlace: Pugputer 6309 - Pico 2 Video v0.2 | VCC | LEFT | RIGHT